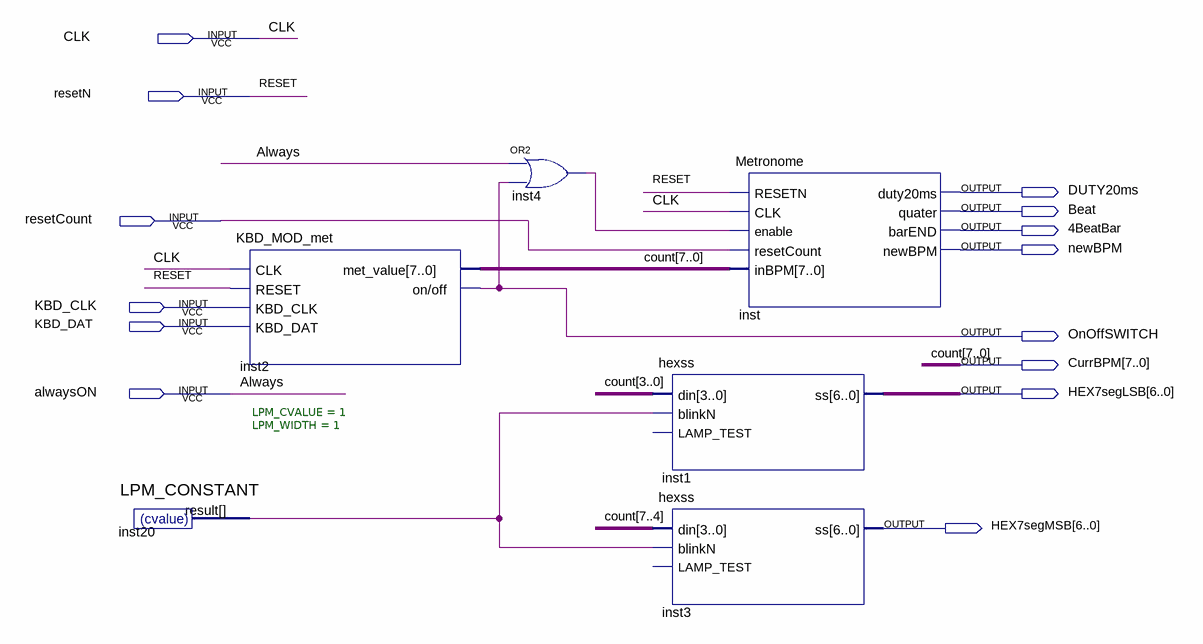
[diagram p0: schematic sheet]
// Quartus schematic Met_Top.bdf as structural Verilog: 6 symbols, 14 pins
module Met_Top (
  input  CLK,
  input  resetN,
  input  resetCount,
  input  KBD_CLK,
  input  KBD_DAT,
  input  alwaysON,
  output DUTY20ms,
  output Beat,
  output \4BeatBar ,
  output newBPM,
  output OnOffSWITCH,
  output [7:0] CurrBPM,
  output [6:0] HEX7segLSB,
  output [6:0] HEX7segMSB
);

  wire inst4_out, inst20_result;

  LPM_CONSTANT #(.LPM_CVALUE(1), .LPM_WIDTH(1)) inst20 (.result(inst20_result));
  KBD_MOD_met inst2 (
    .CLK(CLK), .RESET(resetN), .KBD_CLK(KBD_CLK), .KBD_DAT(KBD_DAT), .met_value(CurrBPM),
    .\on/off (OnOffSWITCH));
  or inst4 (inst4_out, alwaysON, OnOffSWITCH);
  hexss inst1 (.din(CurrBPM[3:0]), .blinkN(inst20_result), .ss(HEX7segLSB));  // open: LAMP_TEST
  hexss inst3 (.din(CurrBPM[7:4]), .blinkN(inst20_result), .ss(HEX7segMSB));  // open: LAMP_TEST
  Metronome inst (
    .RESETN(resetN), .CLK(CLK), .enable(inst4_out), .resetCount(resetCount), .inBPM(CurrBPM),
    .duty20ms(DUTY20ms), .quater(Beat), .barEND(\4BeatBar ), .newBPM(newBPM));

  // Other names for the same wires on the sheet: Always = alwaysON; count[7:0] = CurrBPM; RESET = resetN
endmodule
